# Altium project СамПроект.PrjPcb
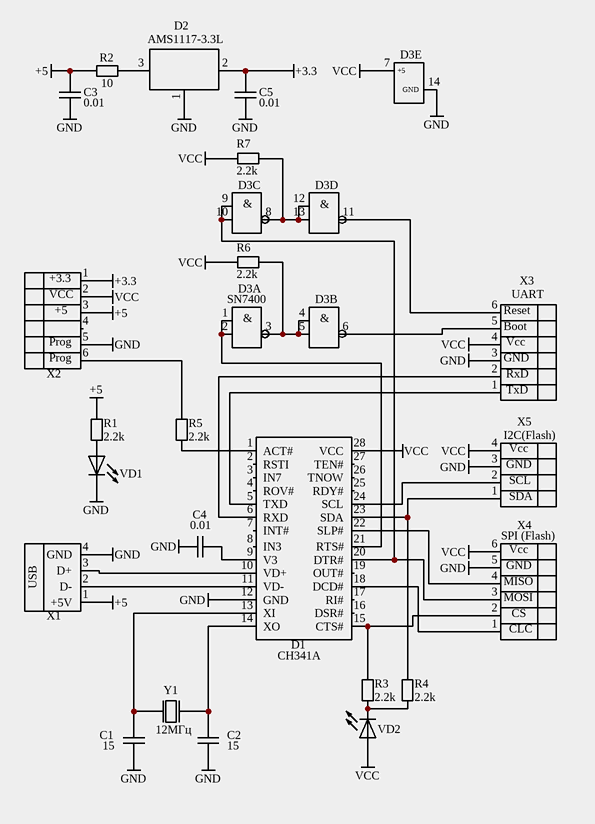
[diagram p0: схема.SchDoc]
1 sheet, 23 parts. Net scope: global (net labels, ports and power ports of the same name join across sheets).
Board file: Плата2.PcbDoc

## Sheet схема.SchDoc
size A4; SheetNumber: 1; SheetTotal: 1

### Parts
C1  15  [0603]
C2  15  [0603]
C3  0.01  [0603]
C4  0.01  [0603]
C5  0.01  [0603]
D1  CH341A  [SOP127-28N]
D2  AMS1117-3.3L  [SOT223-4N]
D3  SN7400  [SOP127-14N]  (parts A,B,C,D,E of 5)
R1  2.2k  [0603]
R2  10  [0603]
R3  2.2k  [0603]
R4  2.2k  [0603]
R5  2.2k  [0603]
R6  2.2k  [0603]
R7  2.2k  [0603]
VD1  LED SMD 0805  [Led Diode 0805]  (value not drawn)
VD2  LED SMD 0805  [Led Diode 0805]  (value not drawn)
X1  USB  [USB-ASM (DS1098-B)]  (value not drawn)
X2  PLC-6  [PLC-6]  (value not drawn)
X3  UART  [PLC-6]
X4  SPI (Flash)  [PLC-6]
X5  I2C(Flash)  [PLC-4]
Y1  12МГц  [HC-49SM]

### Nets
+3.3: C5.2 D2.2 X2.1
+5: C3.2 R1.2 R2.1 X1.1(+5V) X2.3
GND: C1.1 C2.1 C3.1 C4.2 C5.1 D1.12(GND) D2.1 D3.14(GND) VD1.K X1.4(GND) X2.5 X3.3 X4.5 X5.3
VCC: D1.28(VCC) D3.7(+5) R6.2 R7.2 VD2.A X2.2 X3.4 X4.6 X5.4
NetC1_2: C1.2 D1.13(XI) Y1.1
NetC2_2: C2.2 D1.14(XO) Y1.2
NetC4_1: C4.1 D1.9(V3)
NetD1_1: D1.1(ACT#) R5.1
NetD1_5: D1.5(TXD) X3.1
NetD1_6: D1.6(RXD) X3.2
NetD1_10: D1.10(VD+) X1.3(D+)
NetD1_11: D1.11(VD-) X1.2(D-)
NetD1_15: D1.15(CTS#) R3.2 X4.2
NetD1_18: D1.18(DCD#) X4.1
NetD1_20: D1.20(DTR#) D3.9 D3.10 X4.3
NetD1_21: D1.21(RTS#) D3.1 D3.2
NetD1_22: D1.22(SLP#) X4.4
NetD1_23: D1.23(SDA) R4.2 X5.1
NetD1_24: D1.24(SCL) X5.2
NetD2_3: D2.3 R2.2
NetD3_3: D3.3 D3.4 D3.5 R6.1
NetD3_6: D3.6 X3.5
NetD3_8: D3.8 D3.12 D3.13 R7.1
NetD3_11: D3.11 X3.6
NetR1_1: R1.1 VD1.A
NetR3_1: R3.1 R4.1 VD2.K
NetR5_2: R5.2 X2.6

Not connected (* = marked no-connect by the designer): D1 2(RSTI) 3(IN7) 4(ROV#) 7(INT#) 8(IN3) 16(DSR#) 17(RI#) 19(OUT#) 25(RDY#) 26(TNOW) 27(TEN#); X2 4

### Notes on the sheet
- (near X2) +3.3
- (near X2) VCC
- (near X2) Prog
- (near X2) +5
- (near X3) GND
- (near X3) Boot
- (near X3) Reset
- (near X3) Vcc
- (near X3) TxD
- (near X3) RxD
- (near X5) GND
- (near X5) Vcc
- (near X5) SDA
- (near X5) SCL
- (near X4) GND
- (near X4) Vcc
- (near X4) MISO
- (near X4) MOSI
- (near X4) CLC
- (near X4) CS
- (in symbol SN7400, part A) &
- (in symbol SN7400, part B) &
- (in symbol SN7400, part C) &
- (in symbol SN7400, part D) &

### Library data of the parts
C1-C5 = C
R1-R7 = R
X3 X4 = PLC-6
X5 = PLC-4
Y1 = BQ